# Altium schematic sheet Indicators.SchDoc
size A; SheetNumber: 7; SheetTotal: 7
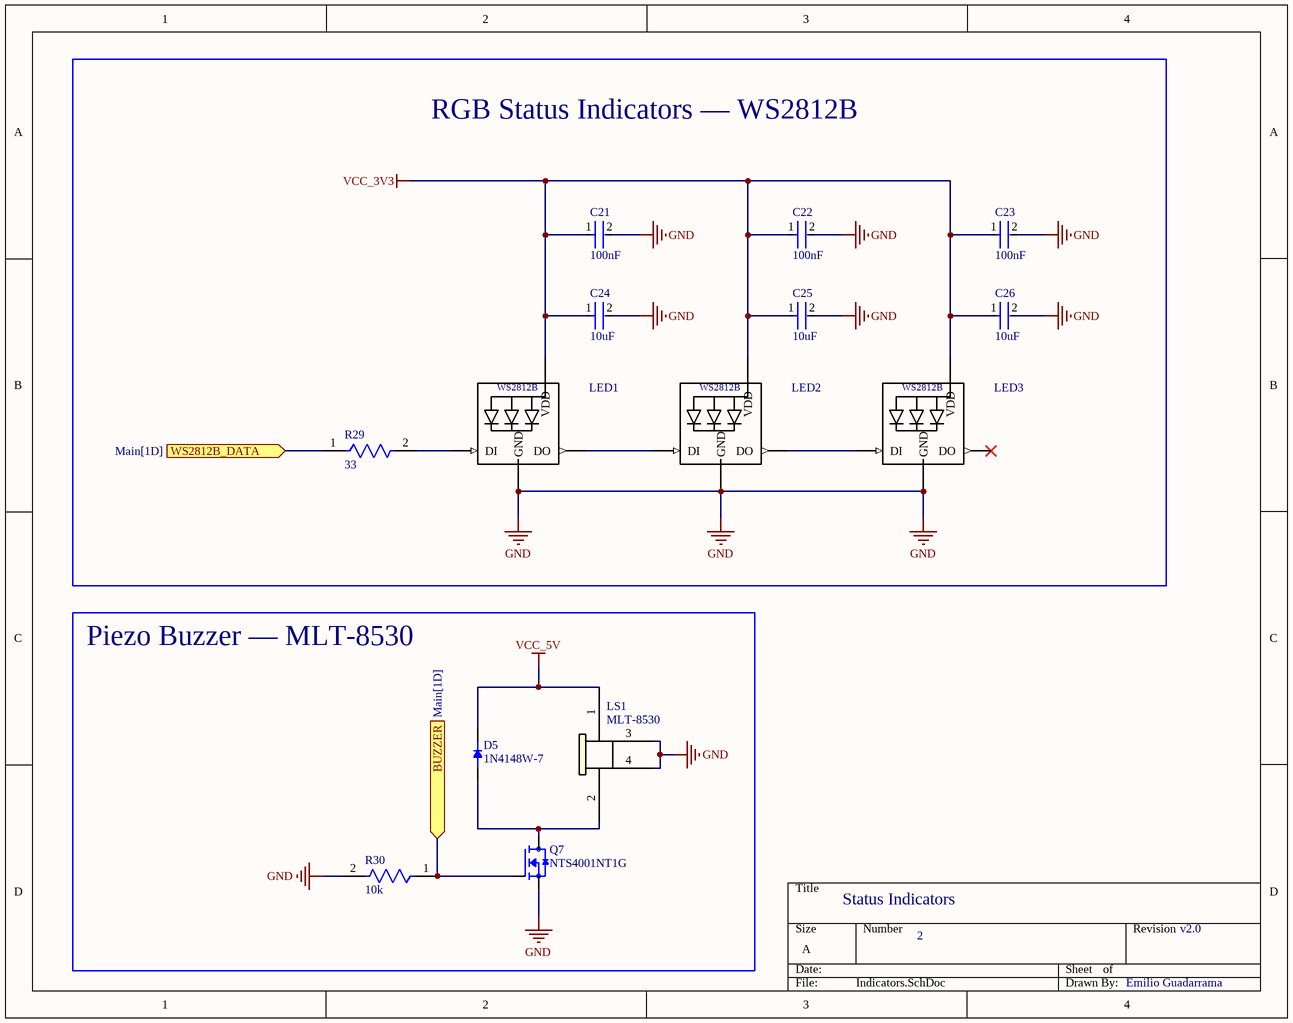
[diagram p0: Indicators.SchDoc]

## Parts
C21  100nF  [FP-C0805C-DN-MFG]
C22  100nF  [FP-C0805C-DN-MFG]
C23  100nF  [FP-C0805C-DN-MFG]
C24  10uF  [FP-C0805C-DN-MFG]
C25  10uF  [FP-C0805C-DN-MFG]
C26  10uF  [FP-C0805C-DN-MFG]
D5  1N4148W-7  [SOD3715X135N]
LED1  WS2812B  [*LED3535]  (value not drawn)
LED2  WS2812B  [*LED3535]  (value not drawn)
LED3  WS2812B  [*LED3535]  (value not drawn)
LS1  MLT-8530  [MLT-8530_JHE]
Q7  NTS4001NT1G  [SOT65P220X100-3N]
R29  33  [FP-MCT0603-IPC_A]
R30  10k  [FP-MCT0603-IPC_A]

## Blocks framed on the sheet
RGB Status Indicators — WS2812B: C21-C26 LED1-LED3 R29
Piezo Buzzer — MLT-8530: D5 LS1 Q7 R30

## Ports
BUZZER (in, see Main[1D]), WS2812B_DATA (in, see Main[1D])

## Nets
GND: C21.2 C22.2 C23.2 C24.2 C25.2 C26.2 LED1.3(GND) LED2.3(GND) LED3.3(GND) LS1.3 LS1.4 Q7.2(S) R30.2
VCC_3V3: C21.1 C22.1 C23.1 C24.1 C25.1 C26.1 LED1.1(VDD) LED2.1(VDD) LED3.1(VDD)
VCC_5V: D5.C(K) LS1.1
BUZZER: Q7.1(G) R30.1 ; port BUZZER
WS2812B_DATA: R29.1 ; port WS2812B_DATA
NetD5_A: D5.A LS1.2 Q7.3(D)
NetLED1_2: LED1.2(DO) LED2.4(DI)
NetLED1_4: LED1.4(DI) R29.2
NetLED2_2: LED2.2(DO) LED3.4(DI)

Not connected (* = marked no-connect by the designer): LED3 2(DO)*

## Notes on the sheet
- Status Indicators
- 2
- v2.0
- Emilio Guadarrama

## Library data of the parts
C21-C26 = CMP-2007-00279-2: CAP CER 0.1UF 50V X7R 0805; Manufacturer Part Number: C0805C104K5RACTU; Manufacturer: KEMET; Value: 0.10 μF; Tolerance: 0.1; Temperature Coefficient: 30ppm/°C; Material: Ceramic; Device Class L2: Capacitors; Temperature Range Low: -55°C; Voltage Rating: 50 V; Digikey Description: CAP CER 0.1UF 50V X7R 0805; Category: Cap; ComponentLink2Description: Datasheet; Octopart: https://octopart.com/c0805c104k5ractu-kemet-143926; RoHS: TRUE; ComponentLink2URL: https://content.kemet.com/datasheets/KEM_C1003_C0G_SMD.pdf; Temperature Characteristic: X7R; Temperature: -55°C to +125°C; Height: 0.88mm; Temperature Range High: +125°C; Device Class L1: Passive Components; Automotive: No; Lead Free: Yes; Ipc Land Pattern Name: CAPC200125X78; Device Class L3: Ceramic Capacitors; Mouser Description: Cap Ceramic 0.1uF 50V X7R 10% SMD 2.0 x 1.2 mm 125 C Paper T/R; Capacitance: 0.10 μF; Package: C0805C-DN
D5 = 1N4148W-7: Diode Standard 100 V 300mA (DC) Surface Mount SOD-123; MF: Diodes Inc.; SnapEDA_Link: https://www.snapeda.com/parts/1N4148W-7/Diodes+Inc./view-part/?ref=snap; Package: SOD-123 Fairchild Semiconductor; Value: *; MP: 1N4148W-7; Check_prices: https://www.snapeda.com/parts/1N4148W-7/Diodes+Inc./view-part/?ref=eda
LED1-LED3 = WS2812B: Intelligent control LED integrated light source; MF: Worldsemi; SnapEDA_Link: https://www.snapeda.com/parts/WS2812B/Worldsemi/view-part/?ref=snap; Package: None; MP: WS2812B; Check_prices: https://www.snapeda.com/parts/WS2812B/Worldsemi/view-part/?ref=eda; Value: *
LS1 = MLT-8530: Description; Manufacturer_Name: Jiangsu Huaneng Elec; Copyright: Copyright (C) 2025 Ultra Librarian. All rights reserved.; Manufacturer_Part_Number: MLT-8530; RefDes: RefDes; Type: Type
Q7 = NTS4001NT1G: N-Channel 30V 270mA _Ta_ 330mW _Ta_ Surface Mount SC-70-3 _SOT323_; MF: ON Semiconductor; Package: SC-70 ON Semiconductor; MP: NTS4001NT1G; SnapEDA_Link: https://www.snapeda.com/parts/NTS4001NT1G/ON%20Semiconductor/view-part/274588/?ref=snap; Price: None; Value: *; Availability: Unavailable
R29 R30 = CMP-02407-011165-1: RES SMD 100 OHM 1% 1/8W 0603; Temperature Coefficient: 25ppm/°C; Resistance: 20kR; Power Rating: 125mW; Tolerance: 0.1%; Voltage Rating: 75V; Length: 1.55mm; Case Code (Imperial): 0603; Case/Package: 0603; Construction: Rectangular; Package Quantity: 1000; Number of Terminations: 2; Termination: SMD/SMT; Resistor Type: Thin Film; Features: Automotive AEC-Q200; Series: MCT 0603 - Precision; Max Operating Temperature: 155°C; Depth: 0.85mm; Max Power Dissipation: 125mW; Min Operating Temperature: -55°C; Width: 0.033inch; Case Code (Metric): 1608; Packaging: Tape and Reel; Weight: 6.7E-05oz; Military Standard: Not; Height: 0.022inch